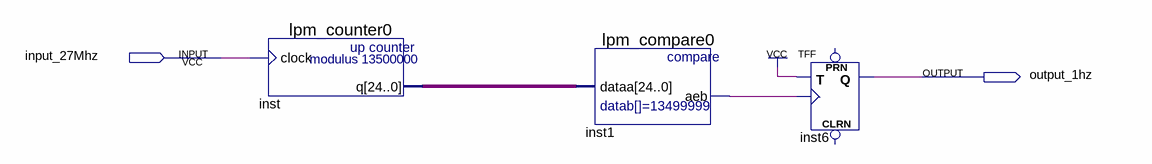
[diagram p0: schematic sheet]
// Quartus schematic clock_27mhz.bdf as structural Verilog: 3 symbols, 2 pins
module clock_27mhz (
  input  input_27Mhz,
  output output_1hz
);

  wire inst1_aeb;
  wire [24:0] inst_q;

  lpm_counter0 inst (.clock(input_27Mhz), .q(inst_q));
  lpm_compare0 inst1 (.dataa(inst_q), .aeb(inst1_aeb));
  TFF inst6 (.T(1'b1), .CLK(inst1_aeb), .Q(output_1hz));  // open: PRN, CLRN
endmodule
